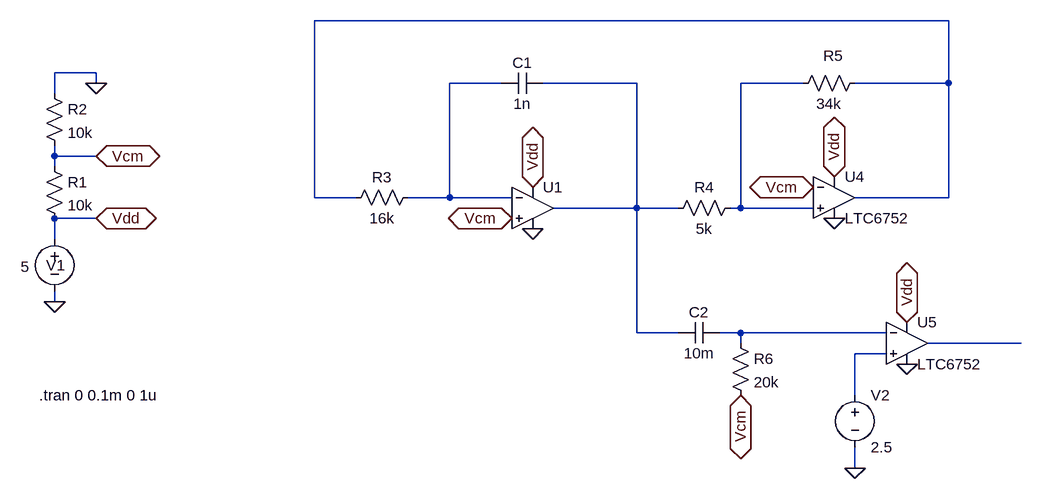
[diagram p0: schematic exp1_simulation3.asc]
exp1_simulation3.asc, the LTspice schematic file:
Version 4
SHEET 1 880 680
WIRE -960 -608 -1936 -608
WIRE -2272 -528 -2336 -528
WIRE -2272 -512 -2272 -528
WIRE -1648 -512 -1728 -512
WIRE -1440 -512 -1584 -512
WIRE -1184 -512 -1280 -512
WIRE -960 -512 -960 -608
WIRE -960 -512 -1104 -512
WIRE -2336 -496 -2336 -528
WIRE -2336 -400 -2336 -416
WIRE -2272 -400 -2336 -400
WIRE -2336 -384 -2336 -400
WIRE -1936 -336 -1936 -608
WIRE -1872 -336 -1936 -336
WIRE -1728 -336 -1728 -512
WIRE -1728 -336 -1792 -336
WIRE -1632 -336 -1728 -336
WIRE -960 -336 -960 -512
WIRE -960 -336 -1104 -336
WIRE -1440 -320 -1440 -512
WIRE -1440 -320 -1568 -320
WIRE -1376 -320 -1440 -320
WIRE -1280 -320 -1280 -512
WIRE -1280 -320 -1296 -320
WIRE -1168 -320 -1280 -320
WIRE -2272 -304 -2336 -304
WIRE -2336 -272 -2336 -304
WIRE -2336 -176 -2336 -192
WIRE -1440 -128 -1440 -320
WIRE -1376 -128 -1440 -128
WIRE -1280 -128 -1312 -128
WIRE -1056 -128 -1280 -128
WIRE -1280 -112 -1280 -128
WIRE -848 -112 -992 -112
WIRE -1056 -96 -1104 -96
WIRE -1104 -32 -1104 -96
WIRE -1104 80 -1104 48
FLAG -2336 -176 0
FLAG -2272 -512 0
FLAG -1600 -288 0
FLAG -1024 -80 0
FLAG -1104 80 0
FLAG -2272 -304 Vdd
IOPIN -2272 -304 BiDir
FLAG -1600 -352 Vdd
IOPIN -1600 -352 BiDir
FLAG -1136 -368 Vdd
IOPIN -1136 -368 BiDir
FLAG -1024 -144 Vdd
IOPIN -1024 -144 BiDir
FLAG -2272 -400 Vcm
IOPIN -2272 -400 BiDir
FLAG -1168 -352 Vcm
IOPIN -1168 -352 BiDir
FLAG -1632 -304 Vcm
IOPIN -1632 -304 BiDir
FLAG -1280 -32 Vcm
IOPIN -1280 -32 BiDir
FLAG -1136 -304 0
SYMBOL voltage -2336 -288 R0
WINDOW 0 -13 56 Left 2
WINDOW 3 -52 58 Left 2
WINDOW 123 0 0 Left 0
WINDOW 39 0 0 Left 0
SYMATTR InstName V1
SYMATTR Value 5
SYMBOL res -2352 -400 R0
SYMATTR InstName R1
SYMATTR Value 10k
SYMBOL res -2352 -512 R0
SYMATTR InstName R2
SYMATTR Value 10k
SYMBOL cap -1584 -528 R90
WINDOW 0 0 32 VBottom 2
WINDOW 3 32 32 VTop 2
SYMATTR InstName C1
SYMATTR Value 1n
SYMBOL res -1776 -352 R90
WINDOW 0 0 56 VBottom 2
WINDOW 3 32 56 VTop 2
SYMATTR InstName R3
SYMATTR Value 16k
SYMBOL res -1280 -336 R90
WINDOW 0 0 56 VBottom 2
WINDOW 3 32 56 VTop 2
SYMATTR InstName R4
SYMATTR Value 5k
SYMBOL res -1088 -528 R90
WINDOW 0 -11 49 VBottom 2
WINDOW 3 32 56 VTop 2
SYMATTR InstName R5
SYMATTR Value 34k
SYMBOL cap -1312 -144 R90
WINDOW 0 0 32 VBottom 2
WINDOW 3 32 32 VTop 2
SYMATTR InstName C2
SYMATTR Value 10m
SYMBOL res -1296 -128 R0
SYMATTR InstName R6
SYMATTR Value 20k
SYMBOL voltage -1104 -48 R0
WINDOW 123 0 0 Left 0
WINDOW 39 0 0 Left 0
SYMATTR InstName V2
SYMATTR Value 2.5
SYMBOL Opamps\\UniversalOpamp2 -1600 -320 R0
SYMATTR InstName U1
SYMBOL Comparators\\LTC6752 -1136 -400 R0
SYMATTR InstName U4
SYMBOL Comparators\\LTC6752 -1024 -176 R0
SYMATTR InstName U5
TEXT -2360 -32 Left 2 !.tran 0 0.1m 0 1u

The netlist it stands for:
* exp1_simulation3.asc
V1 Vdd 0 5
R1 Vcm Vdd 10k
R2 0 Vcm 10k
C1 N003 N002 1n
R3 N002 N001 16k
R4 N004 N003 5k
R5 N001 N004 34k
C2 N005 N003 10m
R6 N005 Vcm 20k
V2 N007 0 2.5
XU1 Vcm N002 Vdd 0 N003 level.2 Avol=1Meg GBW=10Meg Slew=10Meg ilimit=25m rail=0 Vos=0 phimargin=45 en=0 enk=0 in=0 ink=0 Rin=500Meg  ; pins IN+ IN- V+ V- OUT
XU4 N004 Vcm Vdd 0 N001 LTC6752  ; pins In+ In- V+ V- OUT
XU5 N007 N005 Vdd 0 N006 LTC6752  ; pins In+ In- V+ V- OUT
.tran 0 0.1m 0 1u
.lib UniversalOpamps2.sub
.lib LTC7.lib
.backanno
.end